# EAGLE design FLD Logic (autorouted) (EAGLE 6.5.0)
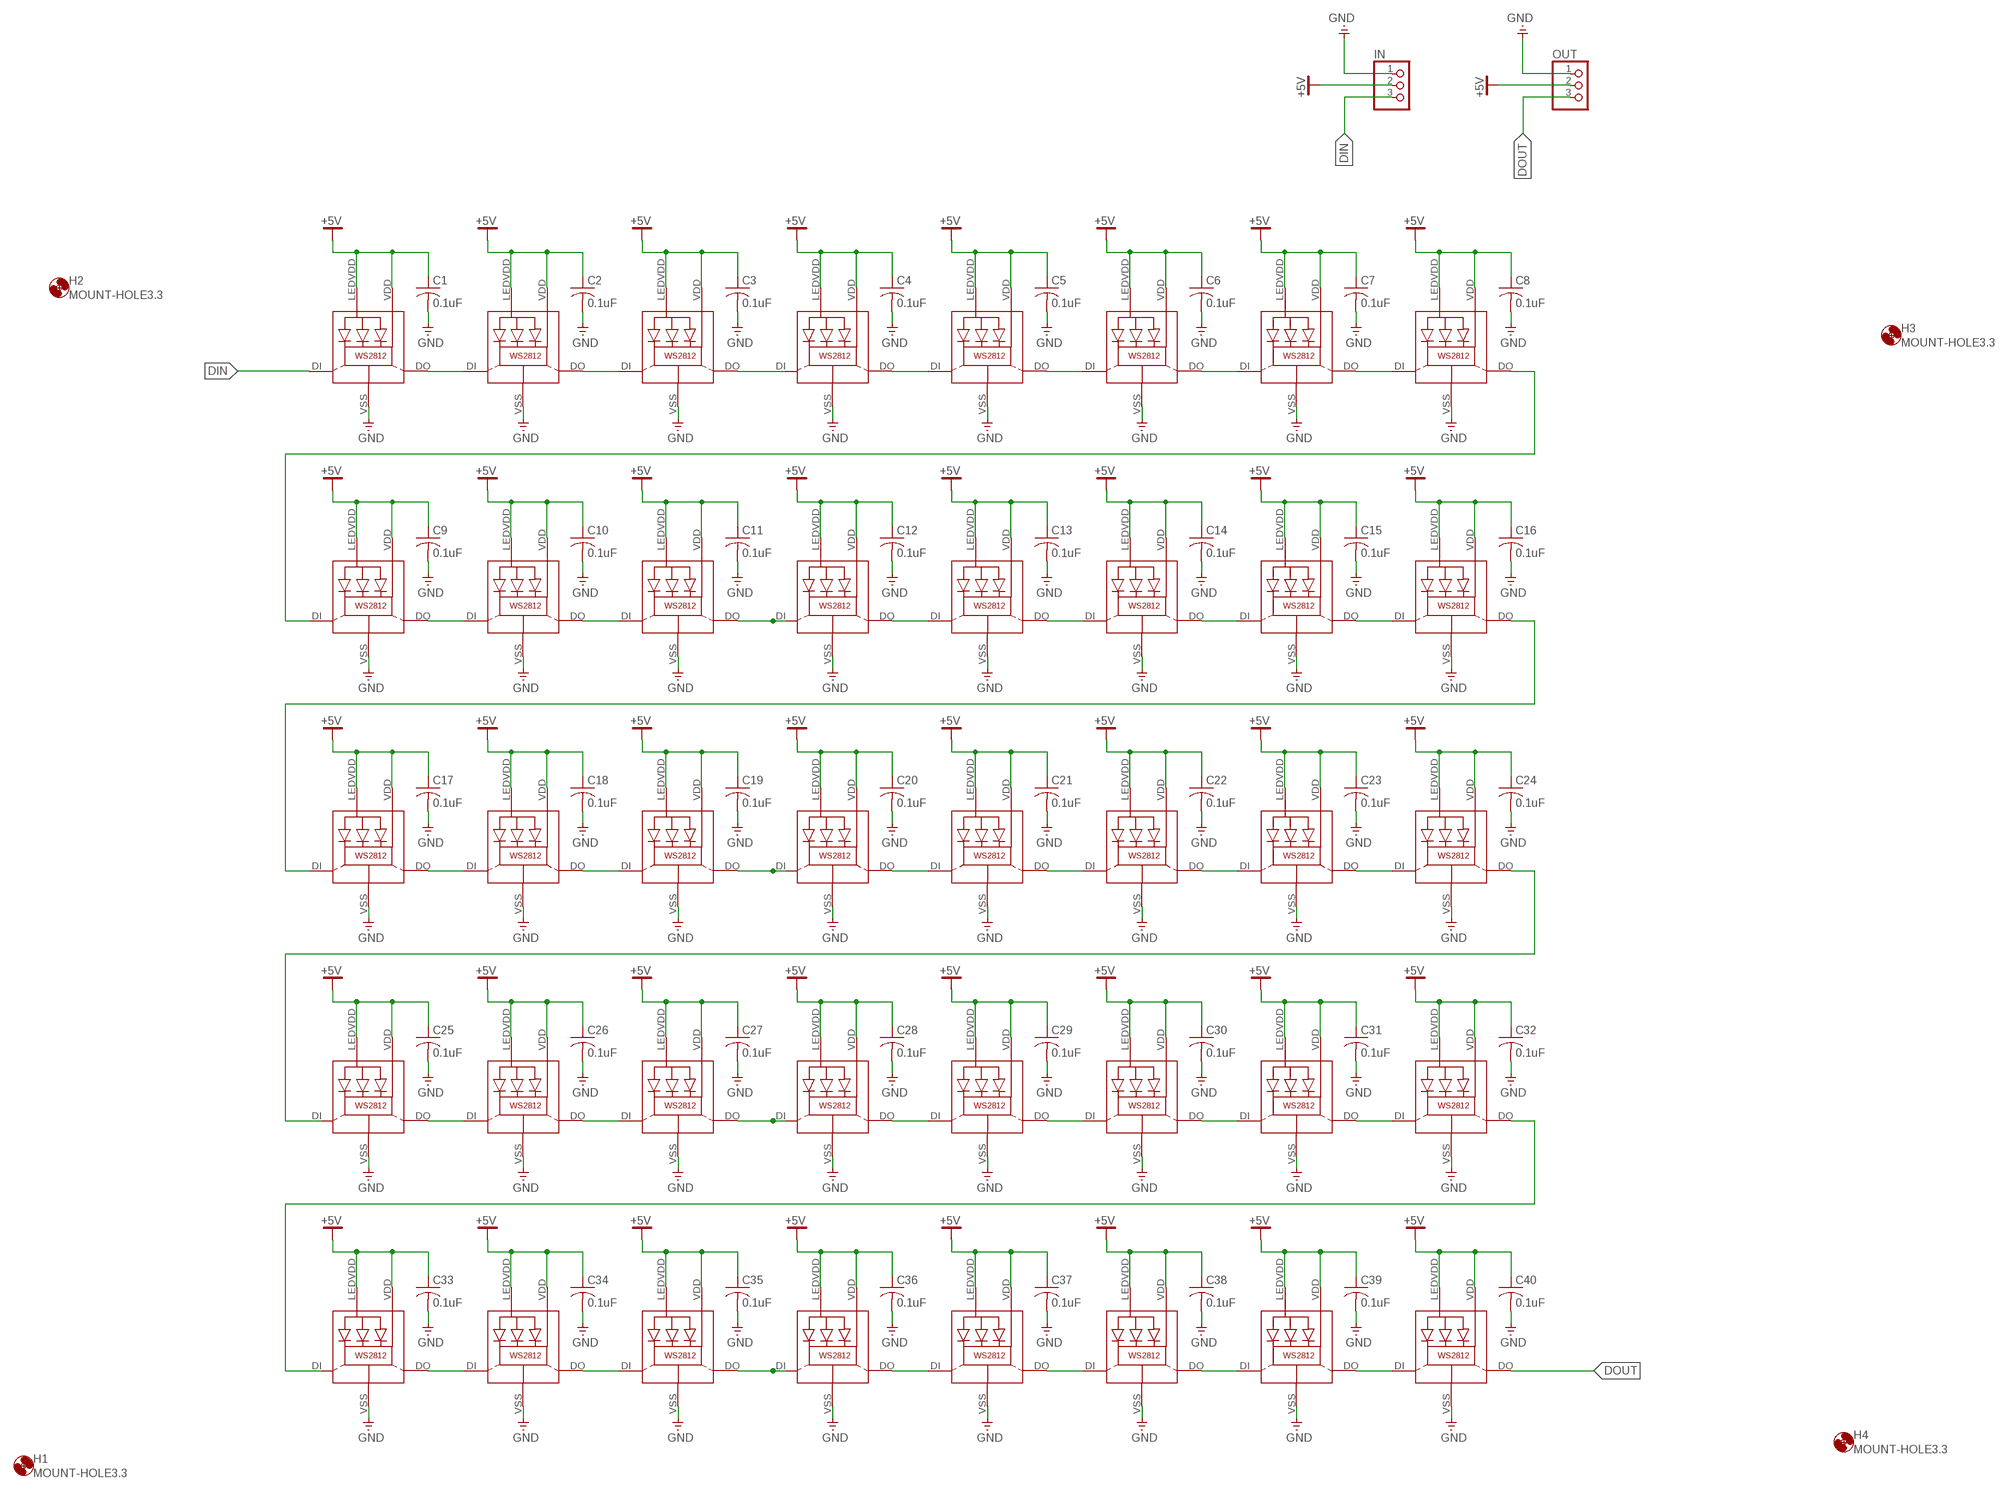
[diagram p0: schematic, sheet 1]

## Parts
C1  0.1uF  C-USC0603  [C0603]
C2  0.1uF  C-USC0603  [C0603]
C3  0.1uF  C-USC0603  [C0603]
C4  0.1uF  C-USC0603  [C0603]
C5  0.1uF  C-USC0603  [C0603]
C6  0.1uF  C-USC0603  [C0603]
C7  0.1uF  C-USC0603  [C0603]
C8  0.1uF  C-USC0603  [C0603]
C9  0.1uF  C-USC0603  [C0603]
C10  0.1uF  C-USC0603  [C0603]
C11  0.1uF  C-USC0603  [C0603]
C12  0.1uF  C-USC0603  [C0603]
C13  0.1uF  C-USC0603  [C0603]
C14  0.1uF  C-USC0603  [C0603]
C15  0.1uF  C-USC0603  [C0603]
C16  0.1uF  C-USC0603  [C0603]
C17  0.1uF  C-USC0603  [C0603]
C18  0.1uF  C-USC0603  [C0603]
C19  0.1uF  C-USC0603  [C0603]
C20  0.1uF  C-USC0603  [C0603]
C21  0.1uF  C-USC0603  [C0603]
C22  0.1uF  C-USC0603  [C0603]
C23  0.1uF  C-USC0603  [C0603]
C24  0.1uF  C-USC0603  [C0603]
C25  0.1uF  C-USC0603  [C0603]
C26  0.1uF  C-USC0603  [C0603]
C27  0.1uF  C-USC0603  [C0603]
C28  0.1uF  C-USC0603  [C0603]
C29  0.1uF  C-USC0603  [C0603]
C30  0.1uF  C-USC0603  [C0603]
C31  0.1uF  C-USC0603  [C0603]
C32  0.1uF  C-USC0603  [C0603]
C33  0.1uF  C-USC0603  [C0603]
C34  0.1uF  C-USC0603  [C0603]
C35  0.1uF  C-USC0603  [C0603]
C36  0.1uF  C-USC0603  [C0603]
C37  0.1uF  C-USC0603  [C0603]
C38  0.1uF  C-USC0603  [C0603]
C39  0.1uF  C-USC0603  [C0603]
C40  0.1uF  C-USC0603  [C0603]
H1  MOUNT-HOLE3.3  [3,3]
H2  MOUNT-HOLE3.3  [3,3]
H3  MOUNT-HOLE3.3  [3,3]
H4  MOUNT-HOLE3.3  [3,3]
IN  PINHD-1X3  [1X03]
LED1  WS2812  [WS2812]
LED2  WS2812  [WS2812]
LED3  WS2812  [WS2812]
LED4  WS2812  [WS2812]
LED5  WS2812  [WS2812]
LED6  WS2812  [WS2812]
LED7  WS2812  [WS2812]
LED8  WS2812  [WS2812]
LED9  WS2812  [WS2812]
LED10  WS2812  [WS2812]
LED11  WS2812  [WS2812]
LED12  WS2812  [WS2812]
LED13  WS2812  [WS2812]
LED14  WS2812  [WS2812]
LED15  WS2812  [WS2812]
LED16  WS2812  [WS2812]
LED17  WS2812  [WS2812]
LED18  WS2812  [WS2812]
LED19  WS2812  [WS2812]
LED20  WS2812  [WS2812]
LED21  WS2812  [WS2812]
LED22  WS2812  [WS2812]
LED23  WS2812  [WS2812]
LED24  WS2812  [WS2812]
LED25  WS2812  [WS2812]
LED26  WS2812  [WS2812]
LED27  WS2812  [WS2812]
LED28  WS2812  [WS2812]
LED29  WS2812  [WS2812]
LED30  WS2812  [WS2812]
LED31  WS2812  [WS2812]
LED32  WS2812  [WS2812]
LED33  WS2812  [WS2812]
LED34  WS2812  [WS2812]
LED35  WS2812  [WS2812]
LED36  WS2812  [WS2812]
LED37  WS2812  [WS2812]
LED38  WS2812  [WS2812]
LED39  WS2812  [WS2812]
LED40  WS2812  [WS2812]
OUT  PINHD-1X3  [1X03]

## Nets
+5V: C1.1 C2.1 C3.1 C4.1 C5.1 C6.1 C7.1 C8.1 C9.1 C10.1 C11.1 C12.1 C13.1 C14.1 C15.1 C16.1 C17.1 C18.1 C19.1 C20.1 C21.1 C22.1 C23.1 C24.1 C25.1 C26.1 C27.1 C28.1 C29.1 C30.1 C31.1 C32.1 C33.1 C34.1 C35.1 C36.1 C37.1 C38.1 C39.1 C40.1 IN.2 LED1.LEDVDD LED1.VDD LED2.LEDVDD LED2.VDD LED3.LEDVDD LED3.VDD LED4.LEDVDD LED4.VDD LED5.LEDVDD LED5.VDD LED6.LEDVDD LED6.VDD LED7.LEDVDD LED7.VDD LED8.LEDVDD LED8.VDD LED9.LEDVDD LED9.VDD LED10.LEDVDD LED10.VDD LED11.LEDVDD LED11.VDD LED12.LEDVDD LED12.VDD LED13.LEDVDD LED13.VDD LED14.LEDVDD LED14.VDD LED15.LEDVDD LED15.VDD LED16.LEDVDD LED16.VDD LED17.LEDVDD LED17.VDD LED18.LEDVDD LED18.VDD LED19.LEDVDD LED19.VDD LED20.LEDVDD LED20.VDD LED21.LEDVDD LED21.VDD LED22.LEDVDD LED22.VDD LED23.LEDVDD LED23.VDD LED24.LEDVDD LED24.VDD LED25.LEDVDD LED25.VDD LED26.LEDVDD LED26.VDD LED27.LEDVDD LED27.VDD LED28.LEDVDD LED28.VDD LED29.LEDVDD LED29.VDD LED30.LEDVDD LED30.VDD LED31.LEDVDD LED31.VDD LED32.LEDVDD LED32.VDD LED33.LEDVDD LED33.VDD LED34.LEDVDD LED34.VDD LED35.LEDVDD LED35.VDD LED36.LEDVDD LED36.VDD LED37.LEDVDD LED37.VDD LED38.LEDVDD LED38.VDD LED39.LEDVDD LED39.VDD LED40.LEDVDD LED40.VDD OUT.2
DIN: IN.3 LED1.DI
DOUT: LED40.DO OUT.3
GND: C1.2 C2.2 C3.2 C4.2 C5.2 C6.2 C7.2 C8.2 C9.2 C10.2 C11.2 C12.2 C13.2 C14.2 C15.2 C16.2 C17.2 C18.2 C19.2 C20.2 C21.2 C22.2 C23.2 C24.2 C25.2 C26.2 C27.2 C28.2 C29.2 C30.2 C31.2 C32.2 C33.2 C34.2 C35.2 C36.2 C37.2 C38.2 C39.2 C40.2 IN.1 LED1.VSS(GND) LED2.VSS(GND) LED3.VSS(GND) LED4.VSS(GND) LED5.VSS(GND) LED6.VSS(GND) LED7.VSS(GND) LED8.VSS(GND) LED9.VSS(GND) LED10.VSS(GND) LED11.VSS(GND) LED12.VSS(GND) LED13.VSS(GND) LED14.VSS(GND) LED15.VSS(GND) LED16.VSS(GND) LED17.VSS(GND) LED18.VSS(GND) LED19.VSS(GND) LED20.VSS(GND) LED21.VSS(GND) LED22.VSS(GND) LED23.VSS(GND) LED24.VSS(GND) LED25.VSS(GND) LED26.VSS(GND) LED27.VSS(GND) LED28.VSS(GND) LED29.VSS(GND) LED30.VSS(GND) LED31.VSS(GND) LED32.VSS(GND) LED33.VSS(GND) LED34.VSS(GND) LED35.VSS(GND) LED36.VSS(GND) LED37.VSS(GND) LED38.VSS(GND) LED39.VSS(GND) LED40.VSS(GND) OUT.1
N$1: LED4.DO LED5.DI
N$2: LED5.DO LED6.DI
N$3: LED3.DO
N$4: LED7.DO LED8.DI
N$5: LED6.DO LED7.DI
N$6: LED17.DO LED18.DI
N$7: LED9.DO LED10.DI
N$8: LED10.DO LED11.DI
N$9: LED12.DO LED13.DI
N$10: LED13.DO LED14.DI
N$11: LED1.DO LED2.DI
N$12: LED2.DO LED3.DI
N$13: LED11.DO LED12.DI
N$14: LED15.DO LED16.DI
N$15: LED14.DO LED15.DI
N$16: LED16.DO LED17.DI
N$17: LED18.DO LED19.DI
N$18: LED20.DO LED21.DI
N$19: LED21.DO LED22.DI
N$20: LED19.DO LED20.DI
N$21: LED23.DO LED24.DI
N$22: LED22.DO LED23.DI
N$23: LED24.DO
N$24: LED25.DO LED26.DI
N$25: LED26.DO LED27.DI
N$26: LED28.DO LED29.DI
N$27: LED29.DO LED30.DI
N$28: LED27.DO LED28.DI
N$29: LED31.DO LED32.DI
N$30: LED30.DO LED31.DI
N$31: LED32.DO
N$32: LED33.DO LED34.DI
N$33: LED34.DO LED35.DI
N$34: LED36.DO LED37.DI
N$35: LED37.DO LED38.DI
N$36: LED35.DO LED36.DI
N$37: LED39.DO LED40.DI
N$38: LED38.DO LED39.DI
N$41: LED8.DO LED9.DI
Unconnected: LED4.DI LED25.DI LED33.DI

## Library data of the parts
C1-C40 = adafruit:C-US: CAPACITOR, American symbol
H1-H4 = holes:MOUNT-HOLE: MOUNTING HOLE with drill center marker
IN OUT = pinhead:PINHD-1X3: PIN HEADER
LED1-LED40 = adafruit:WS2812

## Board
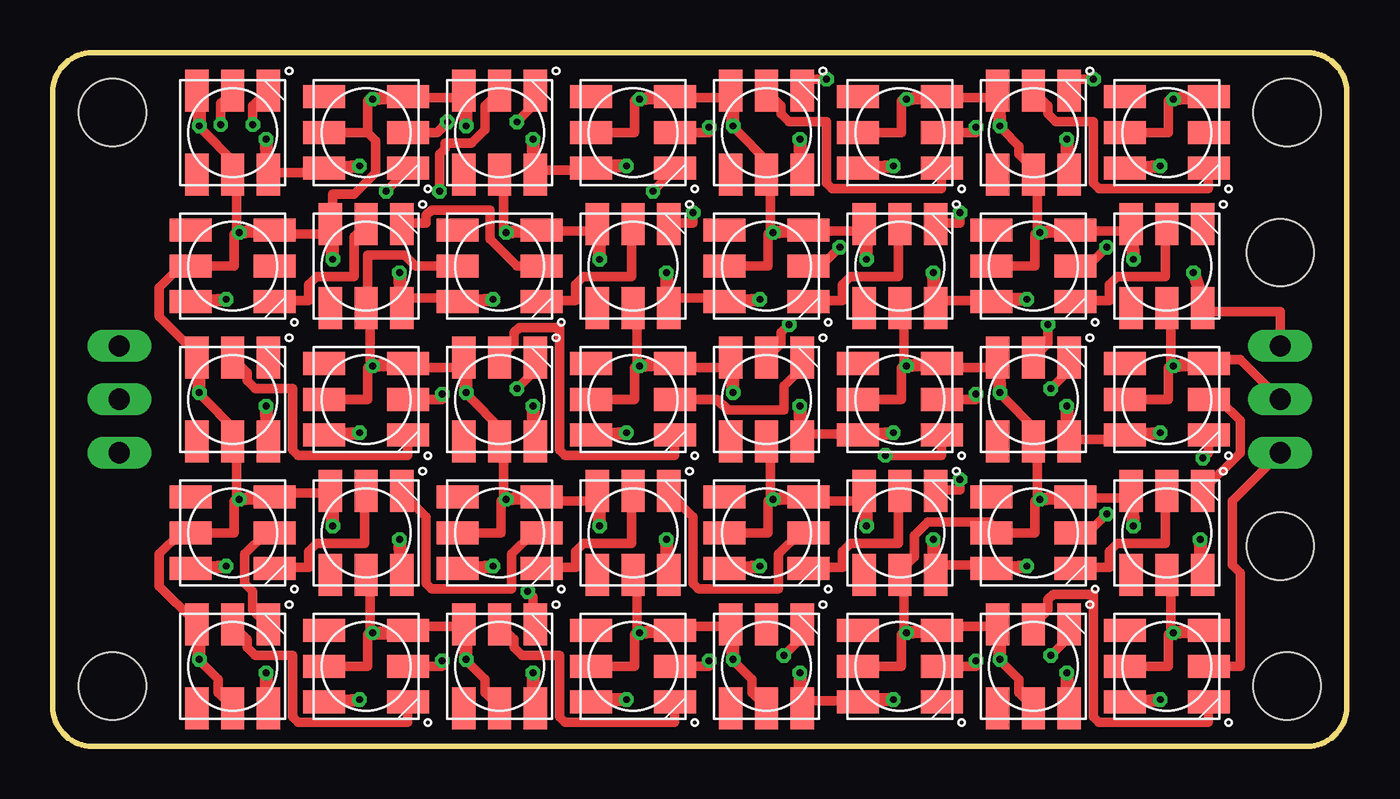
[diagram p1: board, top side]
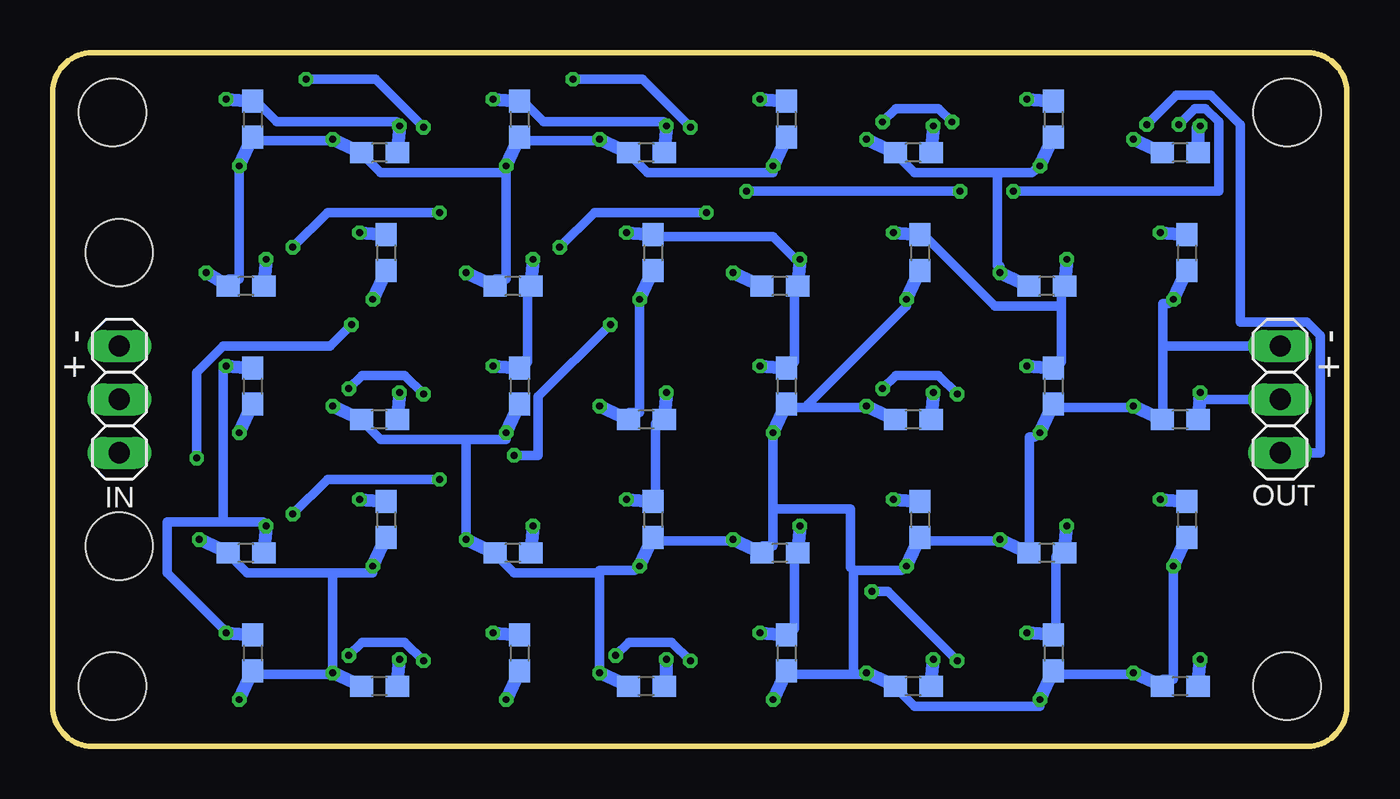
[diagram p2: board, bottom side, seen from below]

Size 61.59 x 33.02 mm. Coordinates in mm from the lower left corner, seen from the top.
Outline: 0,1.91 0,31.11 arc-90 1.91,33.02 59.69,33.02 arc-90 61.59,31.11 61.59,1.91 arc-90 59.69,0 1.91,0 arc-90 0,1.91
Copper layers (1*16): Top 0.0356mm / dielectric 1.5011mm / Bottom 0.0356mm
Design rules "LaenPCBOrder *": minimum track width 18mil, minimum drill 13mil, track to track 6mil, track to pad 6mil, pad to pad 6mil, via to via 6mil, smd to smd 6mil, copper to edge 15mil, drill to drill 6mil, minimum pad ring 7mil, minimum via ring 7mil, stop-mask expansion 4mil, vias tented up to drill 0mil, thermal gap 10mil
Holes 3.2 mm at 58.74,30.16 58.74,2.86 2.86,2.86 2.86,30.16 58.42,9.53 58.42,23.5

### Footprints (pad centres in the part's own frame; a part is rotated, then mirrored left to right if it is on the bottom)
C0603 = smd 1.1 x 1: 1 -0.85,0; 2 0.85,0
1X03 = drill 1.016 long: 1 -2.54,0; 2 0,0; 3 2.54,0
WS2812 = smd 2 x 1.1: DI 2,0; DO 2,-1.7; LEDVDD -2,0; NC -2,1.7; VDD 2,1.7; VSS -2,-1.7

### Placement (x,y rotation side)
C1  52.07,4.45 270 bottom
C2  46.04,2.86 180 bottom
C3  39.37,4.45 270 bottom
C4  33.34,2.86 180 bottom
C5  26.67,4.45 270 bottom
C6  20.64,2.86 180 bottom
C7  13.97,4.45 270 bottom
C8  7.94,2.86 180 bottom
C9  7.62,10.79 270 bottom
C10  14.29,9.21 180 bottom
C11  20.32,10.79 270 bottom
C12  26.99,9.21 180 bottom
C13  33.02,10.79 270 bottom
C14  39.69,9.21 180 bottom
C15  45.72,10.79 270 bottom
C16  52.39,9.21 180 bottom
C17  52.07,17.14 270 bottom
C18  46.04,15.56 180 bottom
C19  39.37,17.14 270 bottom
C20  33.34,15.56 180 bottom
C21  26.67,17.14 270 bottom
C22  20.64,15.56 180 bottom
C23  13.97,17.14 270 bottom
C24  7.94,15.56 180 bottom
C25  7.62,23.5 270 bottom
C26  14.29,21.91 180 bottom
C27  20.32,23.5 270 bottom
C28  26.99,21.91 180 bottom
C29  33.02,23.5 270 bottom
C30  39.69,21.91 180 bottom
C31  45.72,23.5 270 bottom
C32  52.39,21.91 180 bottom
C33  52.07,29.84 270 bottom
C34  46.04,28.26 180 bottom
C35  39.37,29.84 270 bottom
C36  33.34,28.26 180 bottom
C37  26.67,29.84 270 bottom
C38  20.64,28.26 180 bottom
C39  13.97,29.84 270 bottom
C40  7.94,28.26 180 bottom
IN  58.42,16.51 270 bottom
LED1  53.02,3.81 0 top
LED2  46.67,3.81 90 top
LED3  40.32,3.81 0 top
LED4  33.97,3.81 90 top
LED5  27.62,3.81 0 top
LED6  21.27,3.81 90 top
LED7  14.92,3.81 0 top
LED8  8.57,3.81 90 top
LED9  8.57,10.16 0 top
LED10  14.92,10.16 90 top
LED11  21.27,10.16 0 top
LED12  27.62,10.16 90 top
LED13  33.97,10.16 0 top
LED14  40.32,10.16 90 top
LED15  46.67,10.16 0 top
LED16  53.02,10.16 90 top
LED17  53.02,16.51 0 top
LED18  46.67,16.51 90 top
LED19  40.32,16.51 0 top
LED20  33.97,16.51 90 top
LED21  27.62,16.51 0 top
LED22  21.27,16.51 90 top
LED23  14.92,16.51 0 top
LED24  8.57,16.51 90 top
LED25  8.57,22.86 0 top
LED26  14.92,22.86 90 top
LED27  21.27,22.86 0 top
LED28  27.62,22.86 90 top
LED29  33.97,22.86 0 top
LED30  40.32,22.86 90 top
LED31  46.67,22.86 0 top
LED32  53.02,22.86 90 top
LED33  53.02,29.21 0 top
LED34  46.67,29.21 90 top
LED35  40.32,29.21 0 top
LED36  33.97,29.21 90 top
LED37  27.62,29.21 0 top
LED38  21.27,29.21 90 top
LED39  14.92,29.21 0 top
LED40  8.57,29.21 90 top
OUT  3.17,16.51 270 bottom

### Tracks (layer width: path | path; a pad name or v marks a point on that pad's centre or on a via)
+5V  (via drill 0.33 pad 0.25)
  Top 0.457: 19.68,5.08 19.68,5.71 LED6.VDD 19.43,5.71 17.02,5.71 LED7.VDD 16.89,5.46 16.38,5.46 16.19,5.4 | LED6.LEDVDD 21.21,1.91 20.57,2.54 20.57,3.17 19.81,3.94 v19.68,4.13 | LED7.LEDVDD 14.99,3.81 14.99,5.33 v15.24,5.4 15.11,5.59 15.11,8 14.99,8.13 LED10.LEDVDD | 6.99,5.08 6.99,5.71 LED8.VDD 6.73,5.97 5.08,7.62 5.08,9.14 6.1,10.16 LED9.LEDVDD 8.64,10.16 8.64,11.68 v8.89,11.75 8.76,11.94 8.76,14.35 8.64,14.48 LED24.LEDVDD 8.64,14.73 8.64,15.11 7.11,16.64 v6.99,16.83 | LED8.LEDVDD 8.51,1.91 7.87,2.54 7.87,3.17 7.11,3.94 v6.99,4.13 | 13.34,11.43 13.34,12.06 LED10.VDD 13.08,12.06 10.79,12.06 LED9.VDD | 14.99,29.21 LED39.LEDVDD | 14.99,29.21 14.99,30.73 v15.24,30.8 | LED39.VDD 17.14,30.86 19.3,30.86 LED38.VDD | LED25.VDD 10.79,24.38 12.95,24.38 LED26.VDD 13.34,25.15 13.34,26.29 14.35,26.29 15.37,27.3 15.37,28.83 14.99,29.21 | v6.99,29.53 7.11,29.34 8.64,27.81 8.64,27.43 LED40.LEDVDD 8.64,27.18 8.76,27.05 8.76,24.64 v8.89,24.45 8.64,24.38 8.64,22.86 LED25.LEDVDD 6.1,22.86 5.08,21.84 5.08,20.45 6.73,18.8 LED24.VDD | LED23.LEDVDD 14.99,16.51 14.99,18.03 v15.24,18.1 15.11,18.29 15.11,20.7 14.99,20.83 LED26.LEDVDD 14.99,21.08 14.99,23.37 16.76,23.37 17.27,22.86 LED27.LEDVDD | LED22.VDD 19.3,18.03 17.14,18.03 LED23.VDD | LED11.LEDVDD 21.34,10.16 21.34,11.68 v21.59,11.75 21.46,11.94 21.46,14.35 21.34,14.48 LED22.LEDVDD 21.34,14.73 21.34,15.11 19.81,16.64 v19.68,16.83 | LED12.VDD 25.65,11.68 23.5,11.68 LED11.VDD | 32.38,5.08 32.38,5.71 LED4.VDD 32.13,5.71 29.84,5.71 LED5.VDD | LED4.LEDVDD 33.91,1.91 33.27,2.54 33.27,3.17 32.51,3.94 v32.38,4.13 | LED5.LEDVDD 27.69,3.81 27.69,5.33 v27.94,5.4 27.81,5.59 27.81,8 27.69,8.13 LED12.LEDVDD
  Top 0.457: LED13.LEDVDD 34.04,10.16 34.04,11.68 v34.29,11.75 34.16,11.94 34.16,14.35 34.04,14.48 LED20.LEDVDD | LED14.VDD 38.35,11.68 36.2,11.68 LED13.VDD | LED38.LEDVDD 21.34,27.18 21.46,27.05 21.46,24.64 v21.59,24.45 | LED27.VDD 23.5,24.51 25.65,24.51 LED28.VDD | LED21.LEDVDD 27.69,16.51 27.69,18.03 v27.94,18.1 27.81,18.29 27.81,20.7 27.69,20.83 LED28.LEDVDD | LED20.VDD 32,18.03 29.84,18.03 LED21.VDD | LED31.LEDVDD 46.74,22.86 46.74,24.38 v46.99,24.45 46.86,24.64 46.86,27.05 46.74,27.18 LED34.LEDVDD 46.74,27.43 45.97,28.19 45.97,28.57 45.21,29.34 v45.09,29.53 | LED32.VDD 51.05,24.51 48.9,24.51 LED31.VDD | LED33.LEDVDD 53.09,29.21 53.09,30.73 v53.34,30.8 | LED35.LEDVDD 40.39,29.21 40.39,30.73 v40.64,30.8 | LED35.VDD 42.55,30.86 44.7,30.86 LED34.VDD | LED37.LEDVDD 27.69,29.21 27.69,30.73 v27.94,30.8 | LED37.VDD 29.84,30.86 32,30.86 LED36.VDD | LED29.LEDVDD 34.04,22.86 34.04,24.38 v34.29,24.45 34.16,24.64 34.16,27.05 34.04,27.18 LED36.LEDVDD 34.04,27.43 34.04,27.81 32.51,29.34 v32.38,29.53 | LED30.VDD 38.35,24.51 36.2,24.51 LED29.VDD | 45.09,5.08 45.09,5.71 LED2.VDD 44.83,5.71 42.55,5.71 LED3.VDD | LED3.LEDVDD 40.39,3.81 40.39,5.33 v40.64,5.4 40.51,5.59 40.51,8 40.39,8.13 LED14.LEDVDD 40.39,8.38 41.02,9.02 41.02,10.03 41.66,10.67 44.58,10.67 44.58,10.29 LED15.LEDVDD 46.74,10.16 46.74,11.68 v46.99,11.75 46.86,11.94 46.86,14.35 46.74,14.48 LED18.LEDVDD 46.74,14.73 46.74,15.11 45.21,16.64 v45.09,16.83 | LED2.LEDVDD 46.61,1.91 45.97,2.54 45.97,3.17 45.21,3.94 v45.09,4.13 | LED17.LEDVDD 53.09,16.51 53.09,18.03 v53.34,18.1 53.21,18.29 53.21,20.7 53.09,20.83 LED32.LEDVDD
  Top 0.457: IN.2 56.52,18.41 55.24,18.41 LED17.VDD | LED19.LEDVDD 40.39,16.51 40.39,18.03 v40.64,18.1 40.51,18.29 40.51,20.7 40.39,20.83 LED30.LEDVDD | LED18.VDD 44.7,18.03 42.55,18.03 LED19.VDD | LED1.LEDVDD 53.09,3.81 53.09,5.33 v53.34,5.4 53.21,5.59 53.21,8 53.09,8.13 LED16.LEDVDD | LED16.VDD 51.05,11.81 48.9,11.81 LED15.VDD
  Top 0.61: v6.99,4.13 6.99,5.08 | v15.24,5.4 16.19,5.4 | v19.68,4.13 19.68,5.08 | LED5.VDD v27.94,5.4 | LED3.VDD v40.64,5.4 | LED1.VDD v53.34,5.4 | LED16.VDD v51.44,10.48 | LED15.VDD v46.99,11.75 | LED14.VDD v38.73,10.48 | LED13.VDD v34.29,11.75 | LED12.VDD v26.04,10.48 | LED11.VDD v21.59,11.75 | v13.34,10.48 13.34,11.43 | LED9.VDD v8.89,11.75 | LED24.VDD v6.99,16.83 | LED25.VDD v8.89,24.45 | LED26.VDD v13.34,23.18 | LED23.VDD v15.24,18.1 | LED22.VDD v19.68,16.83 | LED27.VDD v21.59,24.45 | LED21.VDD v27.94,18.1 | LED20.VDD v32.38,16.83 | LED19.VDD v40.64,18.1 | LED18.VDD v45.09,16.83 | LED17.VDD v53.34,18.1 | LED32.VDD v51.44,23.18 | LED31.VDD v46.99,24.45 | LED30.VDD v38.73,23.18 | LED29.VDD v34.29,24.45 | LED28.VDD v26.04,23.18 | LED39.VDD v15.24,30.8 | LED38.VDD v19.68,29.53 | LED37.VDD v27.94,30.8 | LED36.VDD v32.38,29.53 | LED35.VDD v40.64,30.8 | LED34.VDD v45.09,29.53 | LED33.VDD v53.34,30.8 | LED40.VDD 6.99,31.1 v6.99,29.53 | v32.38,4.13 32.38,5.08 | v45.09,4.13 45.09,5.08
  Bottom 0.457: OUT.2 6.73,16.51 7.01,16.53 | C7.1 13.84,5.59 13.84,9.02 13.59,9.02 C10.1 | C12.1 26.29,9.02 26.29,5.59 26.54,5.59 C5.1 | 13.59,20.95 13.59,18.29 13.84,18.29 C23.1 | 13.59,20.95 13.59,21.72 C26.1 | C28.1 26.29,21.72 26.29,18.29 26.54,18.29 C21.1 | C13.1 32.89,11.94 32.89,15.37 32.64,15.37 C20.1 | C33.1 51.82,30.61 50.93,29.72 45.21,29.72 v45.09,29.53 | 53.47,10.67 51.56,10.67 v51.44,10.48 | 53.47,10.67 56.13,10.67 56.13,8.26 53.47,5.59 v53.34,5.4 | 53.47,10.67 53.47,17.91 v53.34,18.1 | C30.1 38.99,21.72 38.99,18.29 39.24,18.29 C19.1 | C35.1 39.12,30.61 38.23,29.72 32.51,29.72 v32.38,29.53 | v26.04,23.18 26.29,23.24 27.3,24.26 32.77,24.26 C29.1 | 13.59,20.95 16.76,20.95 20.07,24.26 C27.1
  Bottom 0.61: C8.1 v6.99,4.13 | C7.1 v15.24,5.4 | C6.1 v19.68,4.13 | v27.94,5.4 C5.1 | v40.64,5.4 C3.1 | v53.34,5.4 C1.1 | v51.44,10.48 C16.1 | v46.99,11.75 C15.1 | v38.73,10.48 C14.1 | v34.29,11.75 C13.1 | v26.04,10.48 C12.1 | v21.59,11.75 C11.1 | C10.1 v13.34,10.48 | v8.89,11.75 C9.1 | v6.99,16.83 7.01,16.53 C24.1 | v8.89,24.45 C25.1 | v13.34,23.18 C26.1 | v15.24,18.1 C23.1 | v19.68,16.83 C22.1 | v21.59,24.45 C27.1 | v27.94,18.1 C21.1 | v32.38,16.83 C20.1 | v40.64,18.1 C19.1 | v45.09,16.83 C18.1 | v53.34,18.1 C17.1 | v51.44,23.18 C32.1 | v46.99,24.45 C31.1 | v38.73,23.18 C30.1 | v34.29,24.45 C29.1 | v26.04,23.18 C28.1 | v15.24,30.8 C39.1 | v19.68,29.53 C38.1 | v27.94,30.8 C37.1 | v32.38,29.53 C36.1 | v40.64,30.8 C35.1 | v45.09,29.53 C34.1 | v53.34,30.8 C33.1 | v6.99,29.53 7.09,29.43 C40.1 | C4.1 32.38,2.86 v32.38,4.13 | C2.1 v45.09,4.13
DIN
  Top 0.457: LED1.DI 56.52,3.81 56.52,8.26 56.13,8.64 56.13,11.68 IN.3
DOUT  (via drill 0.33)
  Top 0.457: v9.53,29.59 9.53,30.48 10.16,31.11 LED40.DO
  Bottom 0.457: v9.53,29.59 8.13,30.99 6.48,30.99 5.08,29.59 5.08,20.19 1.91,20.19 1.27,19.56 1.27,13.97 OUT.3
GND  (via drill 0.33 pad 0.25)
  Top 0.457: 22.86,2.54 22.86,2.41 LED6.VSS | 26.35,2.22 26.16,2.16 25.65,2.16 LED5.VSS | 10.48,2.22 10.29,2.29 LED8.VSS 10.16,2.41 10.16,2.54 | 48.26,2.54 48.26,2.41 LED2.VSS | 54.61,8.89 54.61,8.26 LED16.VSS | LED14.VSS 42.29,8.64 44.45,8.64 LED15.VSS | LED18.VSS 48.64,14.61 50.8,14.61 LED17.VSS | LED28.VSS 29.59,21.34 31.75,21.34 LED29.VSS | LED19.VSS 38.1,14.86 35.94,14.86 LED20.VSS | 54.61,21.59 54.61,20.95 LED32.VSS 54.86,20.7 58.42,20.7 IN.1 | 35.88,27.56 35.94,27.56 LED36.VSS | 45.4,21.27 45.21,21.21 44.7,21.21 LED31.VSS 44.45,21.21 42.29,21.21 LED30.VSS | LED40.VSS 10.54,27.3 12.7,27.3 LED39.VSS | 25.08,27.43 25.53,27.43 LED37.VSS | 26.35,27.62 26.16,27.56 25.78,27.56 LED37.VSS | LED37.VSS 24.89,27.43 23.24,27.43 LED38.VSS | 35.88,2.16 35.81,2.16 LED4.VSS | 35.56,2.41 35.69,2.41 LED4.VSS | 39.05,2.22 38.86,2.16 38.35,2.16 LED3.VSS 38.1,2.16 36.07,2.16 LED4.VSS | LED26.VSS 16.89,21.34 19.05,21.34 LED27.VSS
  Top 0.61: v10.16,3.49 10.16,2.54 | LED7.VSS v14.61,2.22 | v22.86,3.49 22.86,2.54 | v40.01,2.22 39.05,2.22 | LED13.VSS v33.66,8.57 | LED1.VSS v52.7,2.22 | v54.61,9.84 54.61,8.89 | LED15.VSS v46.35,8.57 | v41.91,9.84 LED14.VSS 42.02,8.46 | v29.21,9.84 LED12.VSS 29.32,8.46 | LED11.VSS v20.95,8.57 | v16.51,9.84 LED10.VSS 16.62,8.46 | LED9.VSS v8.26,8.57 | v10.16,16.19 LED24.VSS 10.27,14.81 | LED25.VSS v8.26,21.27 | v16.51,22.54 LED26.VSS 16.62,21.16 | LED23.VSS v14.61,14.92 | LED27.VSS v20.95,21.27 | v22.86,16.19 LED22.VSS 22.97,14.81 | LED21.VSS v27.3,14.92 | v35.56,16.19 LED20.VSS 35.67,14.81 | LED19.VSS v40.01,14.92 | v48.26,16.19 LED18.VSS 48.37,14.81 | LED17.VSS v52.7,14.92 | v54.29,22.54 54.61,21.59 | v46.35,21.27 45.4,21.27 | v41.91,22.54 LED30.VSS 42.02,21.16 | LED29.VSS v33.66,21.27 | v29.21,22.54 LED28.VSS 29.32,21.16 | v10.16,28.89 LED40.VSS 10.27,27.51 | LED39.VSS v14.61,27.62 | LED38.VSS v22.86,28.89 | v27.3,27.62 26.35,27.62 | LED36.VSS v35.56,28.89 | LED35.VSS v40.01,27.62 | v48.26,28.89 LED34.VSS 48.37,27.51 | LED33.VSS v52.7,27.62 | 48.37,2.11 LED2.VSS | 35.88,2.11 35.88,2.16 35.88,2.22 | 22.97,2.11 LED6.VSS | 10.48,2.11 10.48,2.22 | 35.88,27.51 35.88,27.56 35.88,27.62 | 25.08,27.53 25.08,27.43 25.08,27.3 | v35.56,3.49 35.56,2.41 35.56,2.22 | v48.26,3.49 48.26,2.54 | v27.3,2.22 26.35,2.22
  Bottom 0.457: 23.5,3.43 26.42,3.43 C5.2 | 23.5,3.43 23.11,3.43 v22.86,3.49 | v10.16,3.49 10.41,3.43 13.72,3.43 C7.2 | v8.26,8.57 8.26,3.17 8.76,3.17 C8.2 | C6.2 21.34,2.67 20.57,1.91 14.61,1.91 v14.61,2.22 | v16.51,9.84 16.76,9.78 20.07,9.78 C11.2 | v10.16,16.19 10.41,16.13 13.72,16.13 C23.2 | 8.76,19.05 8.76,21.08 8.51,21.08 v8.26,21.27 | 8.76,19.05 8.76,15.88 C24.2 | C10.2 15.11,9.53 15.11,14.73 14.86,14.73 v14.61,14.92 | 8.76,19.05 OUT.1 | 23.5,8.38 23.5,3.43 | 23.5,8.38 21.21,8.38 v20.95,8.57 | C1.2 51.82,3.43 48.51,3.43 v48.26,3.49 48.26,8.26 | 48.26,8.26 46.35,8.26 v46.35,8.57 | 48.26,8.26 52.32,8.26 53.09,9.02 C16.2 | v33.66,21.27 33.66,15.88 34.16,15.88 C20.2 | 41.91,14.61 40.01,14.61 v40.01,14.92 | 41.91,14.61 45.97,14.61 46.74,15.37 C18.2 | 41.91,14.61 v41.91,9.84 | v48.26,28.89 48.51,28.83 51.82,28.83 C33.2 | v52.7,27.62 52.7,22.23 53.21,22.23 C32.2 | v35.56,28.89 35.81,28.83 39.12,28.83 C35.2 | C30.2 40.51,22.23 40.01,22.23 v40.01,27.62 40.13,27.3 45.97,27.3 46.74,28.07 C34.2 | 16.64,27.3 20.57,27.3 21.34,28.07 C38.2 | 16.64,27.3 14.99,27.3 14.86,27.43 v14.61,27.62 | 25.65,16.13 26.42,16.13 C21.2 | 25.65,16.13 23.11,16.13 v22.86,16.19 | 27.3,11.3 27.3,9.53 27.81,9.53 C12.2 | 27.3,11.3 v27.3,14.92 | C13.2 32.77,9.78 29.46,9.78 v29.21,9.84 | v20.95,21.27 20.95,20.95 25.65,16.26 25.65,16.13 | 35.56,8.26 35.56,8.38 33.91,8.38 v33.66,8.57 | 35.56,8.26 v35.56,3.49 | 16.64,27.3 16.64,22.86 16.51,22.86 v16.51,22.54 | C36.2 34.04,28.07 33.27,27.3 27.3,27.3 v27.3,27.62 | 35.56,8.26 39.62,8.26 40.39,9.02 C14.2 | 27.3,11.3 23.62,11.3 23.62,8.51 23.5,8.38
  Bottom 0.61: C8.2 v10.16,3.49 | v14.61,2.22 C7.2 | C6.2 v22.86,3.49 | C3.2 v40.01,2.22 | v33.66,8.57 C13.2 | v52.7,2.22 C1.2 | C16.2 v54.61,9.84 | v46.35,8.57 C15.2 | v41.91,9.84 C14.2 | v29.21,9.84 C12.2 | v20.95,8.57 C11.2 | v16.51,9.84 C10.2 | v8.26,8.57 C9.2 | v10.16,16.19 C24.2 | v8.26,21.27 C25.2 | v16.51,22.54 C26.2 | v14.61,14.92 C23.2 | v20.95,21.27 C27.2 | v22.86,16.19 C22.2 | v27.3,14.92 C21.2 | v35.56,16.19 C20.2 | v40.01,14.92 C19.2 | v48.26,16.19 C18.2 | v52.7,14.92 C17.2 | C32.2 v54.29,22.54 | C31.2 v46.35,21.27 | v41.91,22.54 C30.2 | v33.66,21.27 C29.2 | v29.21,22.54 C28.2 | v10.16,28.89 C40.2 | v14.61,27.62 C39.2 | v22.86,28.89 C38.2 | C37.2 v27.3,27.62 | v35.56,28.89 C36.2 | v40.01,27.62 C35.2 | v48.26,28.89 C34.2 | v52.7,27.62 C33.2 | C4.2 v35.56,3.49 | C2.2 v48.26,3.49 | C5.2 v27.3,2.22
N$1  (via drill 0.33)
  Top 0.457: LED5.DI 31.24,3.81 v31.24,4.06 | v34.8,4.32 35.56,5.08 35.56,5.71 LED4.DO
  Bottom 0.457: v31.24,4.06 32.13,4.95 34.16,4.95 v34.8,4.32
N$2
  Top 0.457: LED6.DI 21.34,5.71 21.97,5.08 21.97,4.7 22.35,4.32 24.13,4.32 24.13,1.4 24.38,1.14 29.59,1.14 29.59,2.03 LED5.DO
N$4
  Top 0.457: LED8.DI 8.64,5.71 9.27,5.08 9.27,4.7 9.65,4.32 11.43,4.32 11.43,1.4 11.68,1.14 16.89,1.14 16.89,2.03 LED7.DO
N$5  (via drill 0.33)
  Top 0.457: LED7.DI 18.54,3.81 v18.54,4.06 | v22.61,7.37 22.86,7.11 22.86,5.84 LED6.DO
  Bottom 0.457: v18.54,4.06 21.84,7.37 v22.61,7.37
N$6  (via drill 0.33)
  Top 0.457: v47.37,20.07 47.37,19.18 46.74,18.54 LED18.DI | v54.74,13.72 54.99,13.97 54.99,14.73 LED17.DO
  Bottom 0.457: v47.37,20.07 48.39,19.05 53.47,19.05 54.74,17.78 v54.74,13.72
N$7
  Top 0.457: LED9.DO 10.67,8.51 12.19,8.51 12.19,9.27 12.57,9.65 14.86,9.65 14.86,12.06 LED10.DI
N$8
  Top 0.457: LED11.DI 22.86,10.16 21.84,9.14 21.84,7.49 18.03,7.49 17.78,7.75 17.78,10.92 16.64,12.06 LED10.DO
N$9
  Top 0.457: LED13.DI 35.56,10.16 34.54,9.14 34.54,7.49 30.73,7.49 30.48,7.75 30.48,10.92 29.34,12.06 LED12.DO
N$10
  Top 0.457: LED13.DO 36.07,8.51 37.59,8.51 37.59,9.27 37.97,9.65 40.26,9.65 40.26,12.06 LED14.DI
N$11
  Top 0.457: LED2.DI 46.74,5.84 47.37,6.48 47.37,6.99 47.62,7.24 49.53,7.24 49.53,1.4 49.78,1.14 54.99,1.14 54.99,2.03 LED1.DO
N$12  (via drill 0.33)
  Top 0.457: LED3.DI 43.94,3.81 v43.94,4.06 | v47.5,4.32 48.26,5.08 48.26,5.71 LED2.DO
  Bottom 0.457: v43.94,4.06 44.83,4.95 46.86,4.95 v47.5,4.32
N$13
  Top 0.457: LED11.DO 23.37,8.51 24.89,8.51 24.89,9.27 25.27,9.65 27.56,9.65 27.56,12.06 LED12.DI
N$14
  Top 0.457: LED15.DO 48.77,8.51 50.29,8.51 50.29,9.27 50.67,9.65 52.96,9.65 52.96,12.06 LED16.DI
N$15  (via drill 0.33)
  Top 0.457: v43.18,12.7 43.18,12.19 42.04,12.19 LED14.DO | v50.16,11.05 49.28,10.16 LED15.DI
  Bottom 0.457: v43.18,12.7 48.51,12.7 v50.16,11.05
N$16
  Top 0.457: LED17.DI 55.5,16.51 56.52,15.49 56.52,13.97 54.74,12.19 LED16.DO
N$17  (via drill 0.33)
  Top 0.457: LED19.DI 43.94,16.51 v43.94,16.76 | v47.5,17.02 48.26,17.78 48.26,18.41 LED18.DO
  Bottom 0.457: v43.94,16.76 44.83,17.65 46.86,17.65 v47.5,17.02
N$18
  Top 0.457: LED21.DI 31.62,16.51 32.13,16 34.8,16 34.8,17.14 35.56,17.91 35.56,18.41 LED20.DO
N$19
  Top 0.457: LED22.DI 21.34,18.54 21.97,19.18 21.97,19.68 22.23,19.94 24.13,19.94 24.13,14.1 24.38,13.84 29.59,13.84 29.59,14.73 LED21.DO
N$20  (via drill 0.33)
  Top 0.457: v35.05,20.07 34.67,19.68 34.67,19.18 34.04,18.54 LED20.DI | v39.62,13.84 42.29,13.84 42.29,14.73 LED19.DO
  Bottom 0.457: v35.05,20.07 38.48,16.64 38.48,13.84 v39.62,13.84
N$21
  Top 0.457: LED24.DI 8.64,18.41 9.27,17.78 9.27,17.4 9.65,17.02 11.43,17.02 11.43,14.1 11.68,13.84 16.89,13.84 16.89,14.73 LED23.DO
N$22  (via drill 0.33)
  Top 0.457: LED23.DI 18.54,16.51 v18.54,16.76 | v22.1,17.02 22.86,17.78 22.86,18.41 LED22.DO
  Bottom 0.457: v18.54,16.76 19.43,17.65 21.46,17.65 v22.1,17.02
N$24
  Top 0.457: LED25.DO 10.67,21.21 12.19,21.21 12.19,21.97 12.57,22.35 14.35,22.35 14.35,24.26 14.86,24.77 LED26.DI
N$25
  Top 0.457: LED27.DI 22.1,22.86 20.83,24.13 20.83,25.53 18.03,25.53 17.78,25.27 17.78,24.89 16.64,24.89 LED26.DO
N$26  (via drill 0.33)
  Top 0.457: v30.48,25.4 30.48,24.89 29.34,24.89 LED28.DO | v37.47,23.75 36.58,22.86 LED29.DI
  Bottom 0.457: v30.48,25.4 35.81,25.4 v37.47,23.75
N$27
  Top 0.457: LED29.DO 36.07,21.21 37.59,21.21 37.59,21.97 37.97,22.35 40.26,22.35 40.26,24.77 LED30.DI
N$28
  Top 0.457: LED27.DO 23.37,21.21 24.89,21.21 24.89,21.97 25.27,22.35 27.56,22.35 27.56,24.77 LED28.DI
N$29
  Top 0.457: LED31.DO 48.77,21.21 50.29,21.21 50.29,21.97 50.67,22.35 52.96,22.35 52.96,24.77 LED32.DI
N$30  (via drill 0.33)
  Top 0.457: v43.18,25.4 43.18,24.89 42.04,24.89 LED30.DO | v50.16,23.75 49.28,22.86 LED31.DI
  Bottom 0.457: v43.18,25.4 48.51,25.4 v50.16,23.75
N$32
  Top 0.457: LED34.DI 46.74,31.11 47.37,30.48 47.37,30.1 47.75,29.72 49.53,29.72 49.53,26.8 49.78,26.54 54.99,26.54 54.99,27.43 LED33.DO
N$33  (via drill 0.33)
  Top 0.457: LED35.DI 43.94,29.21 v43.94,29.46 | v49.53,31.75 48.39,31.75 48.39,31.24 LED34.DO
  Bottom 0.457: v43.94,29.46 46.23,31.75 v49.53,31.75
N$34  (via drill 0.33)
  Top 0.457: LED37.DI 31.24,29.21 v31.24,29.46 | v36.83,31.75 35.69,31.75 35.69,31.24 LED36.DO
  Bottom 0.457: v31.24,29.46 33.53,31.75 v36.83,31.75
N$35  (via drill 0.33)
  Top 0.457: v18.41,26.42 18.41,28.19 18.67,28.45 18.67,28.7 19.94,28.7 20.57,29.34 20.57,30.48 21.21,31.11 LED38.DI | v28.57,26.42 29.59,27.43 LED37.DO
  Bottom 0.457: v28.57,26.42 v18.41,26.42
N$36
  Top 0.457: LED36.DI 34.04,31.11 34.67,30.48 34.67,30.1 35.05,29.72 36.83,29.72 36.83,26.8 37.08,26.54 42.29,26.54 42.29,27.43 LED35.DO
N$37  (via drill 0.33)
  Top 0.457: v8,29.59 8,30.61 8.51,31.11 LED40.DI | v15.88,26.42 16.89,27.43 LED39.DO
  Bottom 0.457: v8,29.59 7.24,30.35 6.73,30.35 6.1,29.72 6.1,26.42 v15.88,26.42
N$38  (via drill 0.33)
  Top 0.457: LED39.DI 18.29,29.21 v18.8,29.72 | v22.1,29.72 22.86,30.48 22.86,31.11 LED38.DO
  Bottom 0.457: v18.8,29.72 19.43,30.35 21.46,30.35 v22.1,29.72
N$41
  Top 0.457: LED9.DI 10.16,10.16 9.14,9.14 9.14,7.75 9.53,7.37 9.53,6.48 10.16,5.84 LED8.DO

### Text on the board
bNames: + - | + -